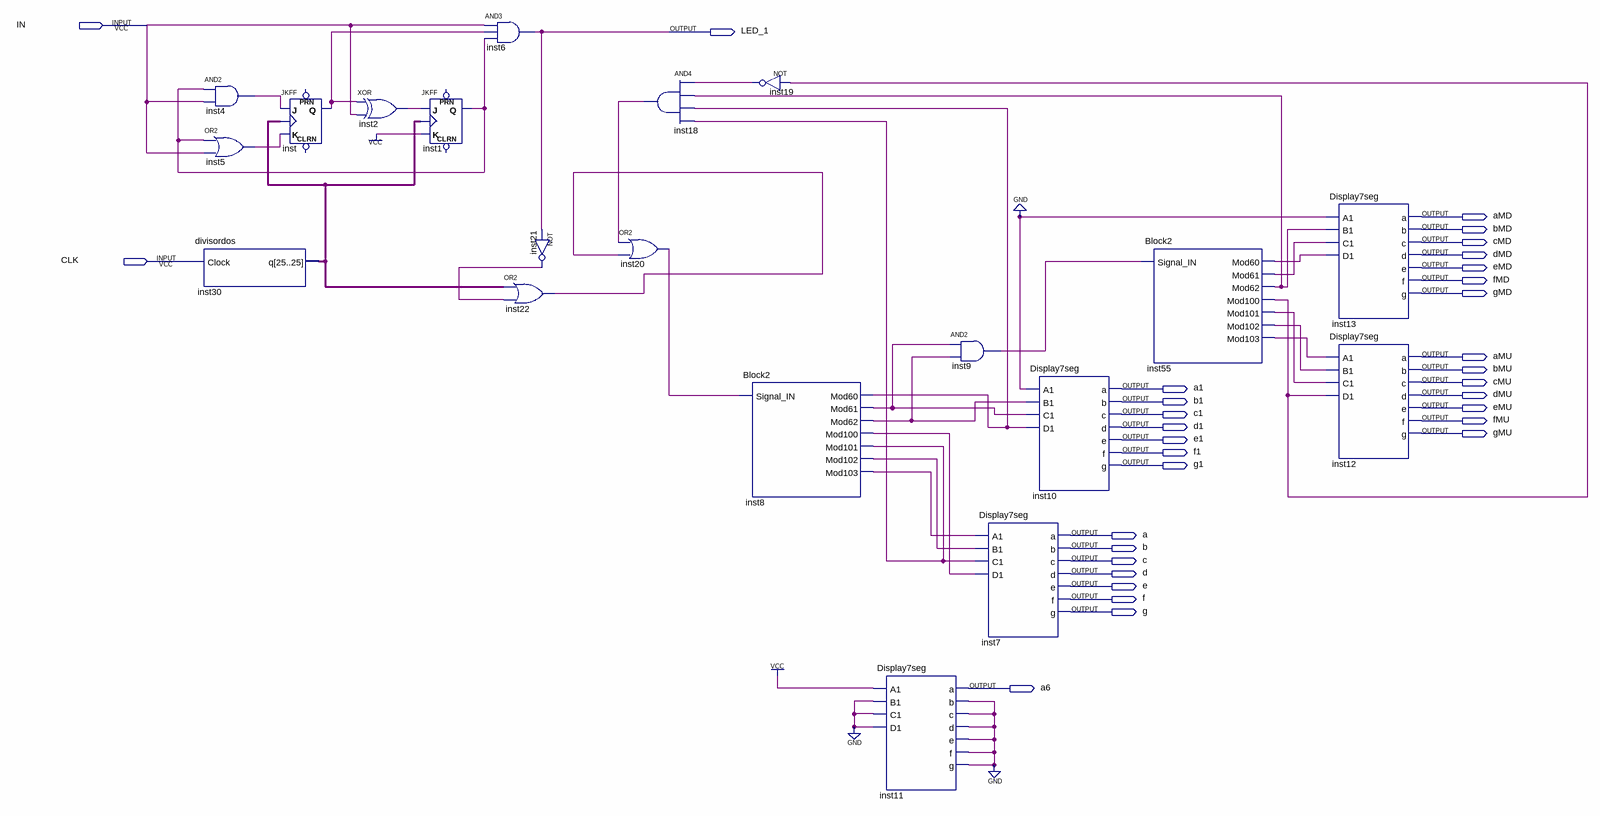
[diagram p0: schematic sheet]
// Quartus schematic ProyectoFinal_CAJA_FUERTE.bdf as structural Verilog: 20 symbols, 32 pins
module ProyectoFinal_CAJA_FUERTE (
  input  IN,
  input  CLK,
  output LED_1,
  output aMD,
  output bMD,
  output cMD,
  output dMD,
  output eMD,
  output fMD,
  output gMD,
  output aMU,
  output bMU,
  output cMU,
  output a1,
  output dMU,
  output b1,
  output eMU,
  output c1,
  output fMU,
  output d1,
  output gMU,
  output e1,
  output f1,
  output g1,
  output a,
  output b,
  output c,
  output d,
  output e,
  output f,
  output g,
  output a6
);

  wire inst1_q, inst2_out, inst4_out, inst5_out, inst8_mod60, inst8_mod61, inst8_mod62, inst8_mod100,
       inst8_mod101, inst8_mod102, inst8_mod103, inst9_out, inst11_b, inst18_out, inst19_out, inst20_out,
       inst21_out, inst22_out, inst30_q, inst55_mod60, inst55_mod61, inst55_mod62, inst55_mod100,
       inst55_mod101, inst55_mod102, inst55_mod103, inst_q;

  and inst4 (inst4_out, inst1_q, IN);
  or inst5 (inst5_out, inst1_q, IN);
  divisordos inst30 (.Clock(CLK), .q(inst30_q));
  JKFF inst (.K(inst5_out), .J(inst4_out), .CLK(inst30_q), .Q(inst_q));  // open: PRN, CLRN
  xor inst2 (inst2_out, inst_q, IN);
  JKFF inst1 (.K(1'b1), .J(inst2_out), .CLK(inst30_q), .Q(inst1_q));  // open: PRN, CLRN
  and inst6 (LED_1, IN, inst_q, inst1_q);
  not inst21 (inst21_out, LED_1);
  or inst22 (inst22_out, inst30_q, inst21_out);
  and inst18 (inst18_out, inst19_out, inst55_mod62, inst8_mod60, inst8_mod101);
  or inst20 (inst20_out, inst18_out, inst22_out);
  Block2 inst8 (
    .Signal_IN(inst20_out), .Mod60(inst8_mod60), .Mod61(inst8_mod61), .Mod62(inst8_mod62),
    .Mod100(inst8_mod100), .Mod101(inst8_mod101), .Mod102(inst8_mod102), .Mod103(inst8_mod103));
  not inst19 (inst19_out, inst55_mod100);
  Display7seg inst11 (
    .A1(1'b1), .B1(1'b0), .C1(1'b0), .D1(1'b0), .a(a6), .b(inst11_b), .c(inst11_b), .d(inst11_b),
    .e(inst11_b), .f(inst11_b), .g(inst11_b));
  and inst9 (inst9_out, inst8_mod61, inst8_mod62);
  Display7seg inst7 (
    .A1(inst8_mod103), .B1(inst8_mod102), .C1(inst8_mod101), .D1(inst8_mod100), .a(a), .b(b), .c(c), .d(d),
    .e(e), .f(f), .g(g));
  Display7seg inst10 (
    .A1(1'b0), .B1(inst8_mod62), .C1(inst8_mod61), .D1(inst8_mod60), .a(a1), .b(b1), .c(c1), .d(d1), .e(e1),
    .f(f1), .g(g1));
  Block2 inst55 (
    .Signal_IN(inst9_out), .Mod60(inst55_mod60), .Mod61(inst55_mod61), .Mod62(inst55_mod62),
    .Mod100(inst55_mod100), .Mod101(inst55_mod101), .Mod102(inst55_mod102), .Mod103(inst55_mod103));
  Display7seg inst13 (
    .A1(1'b0), .B1(inst55_mod62), .C1(inst55_mod61), .D1(inst55_mod60), .a(aMD), .b(bMD), .c(cMD), .d(dMD),
    .e(eMD), .f(fMD), .g(gMD));
  Display7seg inst12 (
    .A1(inst55_mod103), .B1(inst55_mod102), .C1(inst55_mod101), .D1(inst55_mod100), .a(aMU), .b(bMU),
    .c(cMU), .d(dMU), .e(eMU), .f(fMU), .g(gMU));
  // also tied to GND on the sheet: inst11_b
endmodule
